# EAGLE design garage (EAGLE 8.2.2)
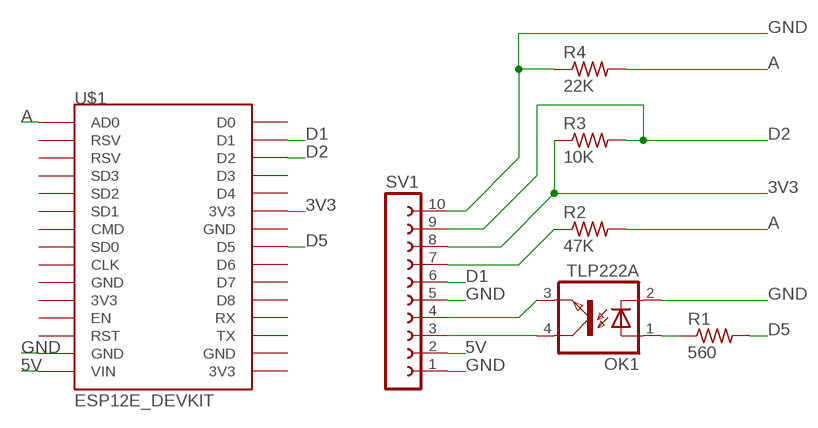
[diagram p0: schematic, sheet 1]

## Parts
OK1  TLP222A  TIL191  [DIL04]
R1  560  R-US_0207/7  [0207/7]
R2  47K  R-US_0207/7  [0207/7]
R3  10K  R-US_0207/7  [0207/7]
R4  22K  R-US_0207/7  [0207/7]
SV1  FE10W  [FE10W]
U$1  ESP12E_DEVKIT  [ESP12E_DEVKIT]

## Nets
3V3: R3.1 SV1.8 U$1.3V3@1(3V3)
5V: SV1.2 U$1.VIN
A: R2.2 R4.2 U$1.AD0
D1: SV1.6 U$1.D1
D2: R3.2 SV1.9 U$1.D2
D5: R1.2 U$1.D5
GND: OK1.2(C) R4.1 SV1.1 SV1.5 SV1.10 U$1.GND@1(GND)
N$1: OK1.4(COL) SV1.3
N$2: OK1.3(EMIT) SV1.4
N$3: OK1.1(A) R1.1
N$4: R2.1 SV1.7
Unconnected: U$1.3V3@0(3V3) U$1.3V3@2(3V3) U$1.CLK U$1.CMD U$1.D0 U$1.D3 U$1.D4 U$1.D6 U$1.D7 U$1.D8 U$1.EN U$1.GND@0(GND) U$1.GND@2(GND) U$1.GND@3(GND) U$1.RST U$1.RSV@0(RSV) U$1.RSV@1(RSV) U$1.RX U$1.SD0 U$1.SD1 U$1.SD2 U$1.SD3 U$1.TX

## Library data of the parts
OK1 = optocoupler-3-jcn:TIL191: TEXAS INSTRUMENTS OPTO COUPLER
R1-R4 = rcl:R-US_: RESISTOR, American symbol
SV1 = con-lsta:FE10W: FEMALE HEADER; OC_FARNELL: unknown; OC_NEWARK: unknown
U$1 = ESP12E_DEVKIT:ESP12E_DEVKIT: ESP12E DEVKIT BOARD

## Board
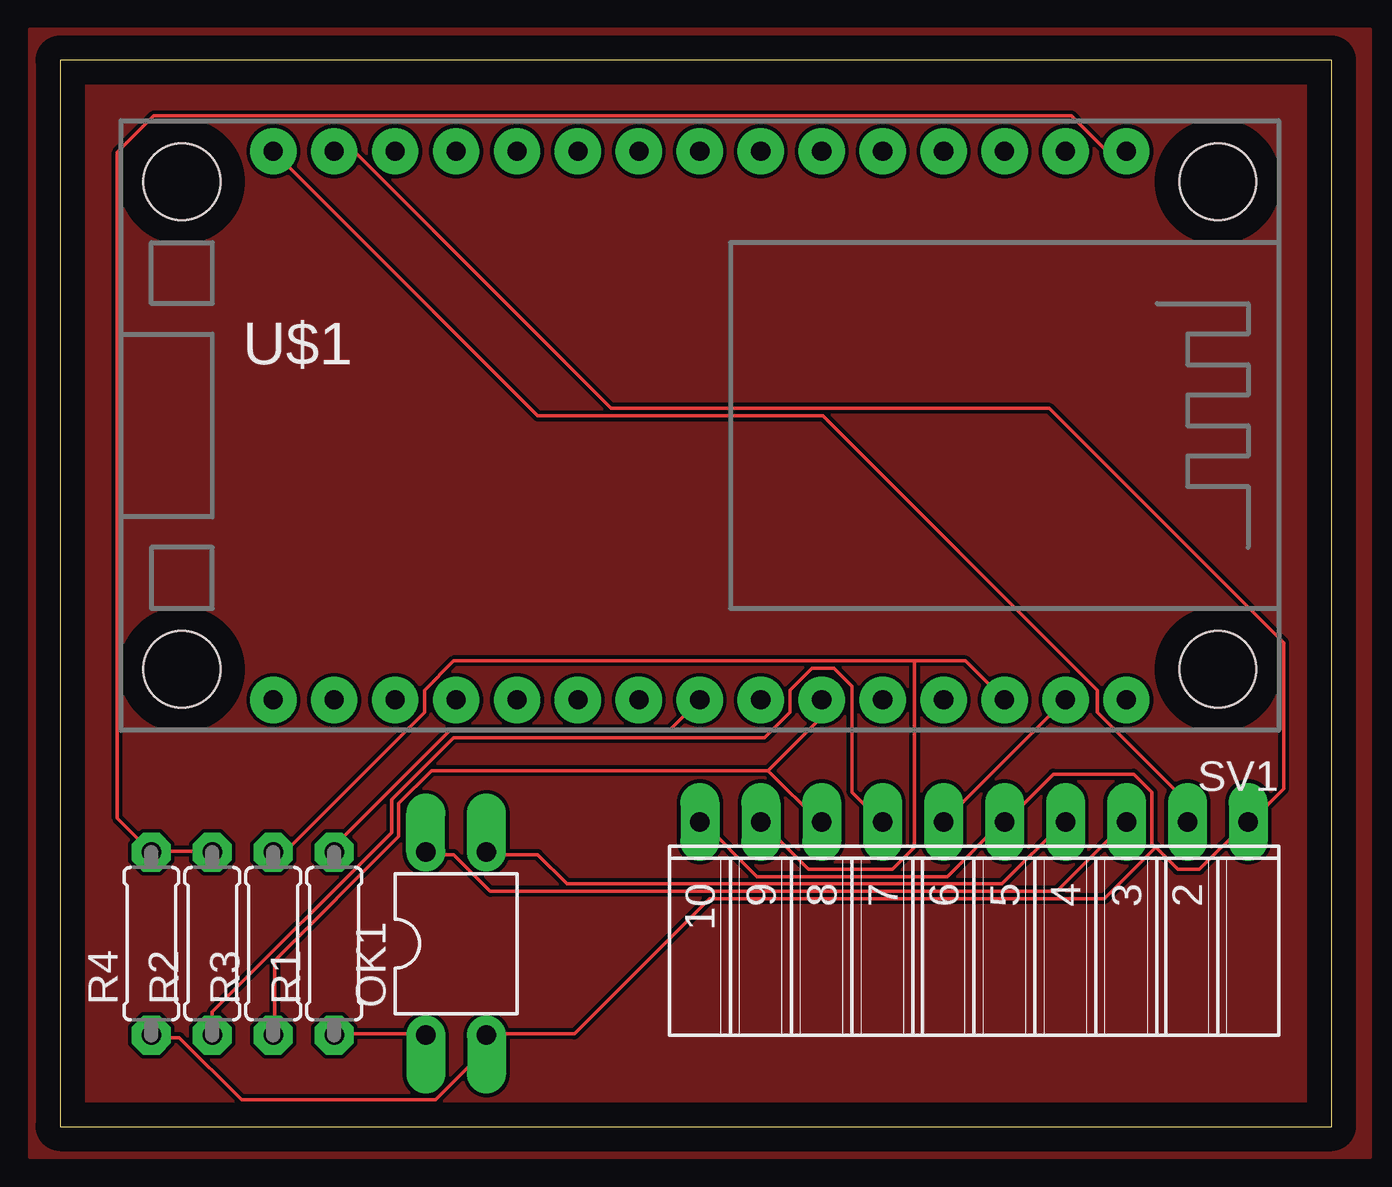
[diagram p1: board, top side]

Size 53.01 x 44.44 mm. Coordinates in mm from the lower left corner, seen from the top.
Outline: 0,0 53.01,0 53.01,44.44 0,44.44 0,0
Copper layers (1*16): Top 0.035mm / dielectric 1.5mm / Bottom 0.035mm
Design rules "default *": minimum track width 6mil, minimum drill 0.35mm, track to track 6mil, track to pad 6mil, pad to pad 6mil, via to via 6mil, smd to smd 6mil, copper to edge 40mil, drill to drill 6mil, minimum pad ring 16mil, minimum via ring 8mil, stop-mask expansion 4mil, vias tented up to drill 0mil, thermal gap 10mil

### Footprints (pad centres in the part's own frame; a part is rotated, then mirrored left to right if it is on the bottom)
DIL04 = drill 0.813 offset: 1 -1.27,-3.81; 2 1.27,-3.81; 3 1.27,3.81; 4 -1.27,3.81
0207/7 = drill 0.813 octagon: 1 -3.81,0; 2 3.81,0
FE10W = drill 0.813 long: 1 -11.43,0; 2 -8.89,0; 3 -6.35,0; 4 -3.81,0; 5 -1.27,0; 6 1.27,0; 7 3.81,0; 8 6.35,0; 9 8.89,0; 10 11.43,0
ESP12E_DEVKIT = drill 0.8 pad 1.93: 3V3@0 -11.43,-7.62; 3V3@1 11.43,5.08; 3V3@2 11.43,-17.78; AD0 -11.43,17.78; CLK -11.43,-2.54; CMD -11.43,2.54; D0 11.43,17.78; D1 11.43,15.24; D2 11.43,12.7; D3 11.43,10.16; D4 11.43,7.62; D5 11.43,0; D6 11.43,-2.54; D7 11.43,-5.08; D8 11.43,-7.62; EN -11.43,-10.16; GND@0 -11.43,-5.08; GND@1 -11.43,-15.24; GND@2 11.43,2.54; GND@3 11.43,-15.24; RST -11.43,-12.7; RSV@0 -11.43,15.24; RSV@1 -11.43,12.7; RX 11.43,-10.16; SD0 -11.43,0; SD1 -11.43,5.08; SD2 -11.43,7.62; SD3 -11.43,10.16; TX 11.43,-12.7; VIN -11.43,-17.78 | hole 3.2: -10.16,21.59; 10.16,21.59; 10.16,-21.59; -10.16,-21.59

### Placement (x,y rotation side)
OK1  16.51,7.62 0 top
R1  11.43,7.62 90 top
R2  6.35,7.62 90 top
R3  8.89,7.62 90 top
R4  3.81,7.62 90 top
SV1  38.1,12.7 180 top
U$1  26.67,29.21 270 top

### Tracks (layer width: path | path; a pad name or v marks a point on that pad's centre or on a via)
3V3
  Top 0.152: 29.52,14.83 15.49,14.83 14.12,13.46 14.12,12.09 8.94,6.91 8.94,3.86 R3.1 | 29.52,14.83 31.65,12.7 SV1.8 | 29.52,14.83 31.65,16.97 31.65,17.73 U$1.3V3@1
5V
  Top 0.152: U$1.VIN 19.91,29.62 31.8,29.62 43.23,18.19 43.23,17.27 46.89,13.61 46.89,12.7 SV1.2
A
  Top 0.152: R2.2 6.35,11.48 3.91,11.48 R4.2 2.39,12.85 2.39,40.59 3.91,42.11 42.16,42.11 43.54,40.74 44.45,40.74 U$1.AD0
D1
  Top 0.152: U$1.D1 SV1.6
D2
  Top 0.152: 35.61,19.41 37.74,19.41 U$1.D2 | 35.61,19.41 16.41,19.41 15.19,18.19 15.19,17.27 9.4,11.48 8.94,11.48 R3.2 | SV1.9 31.19,10.72 34.7,10.72 35.61,11.63 35.61,19.41
D5
  Top 0.152: U$1.D5 25.4,16.51 16.26,16.51 11.53,11.79 11.53,11.48 R1.2
GND
  Top 0.152: R4.1 3.91,3.71 4.98,3.71 7.57,1.12 15.65,1.12 17.78,3.25 OK1.2 17.78,3.86 21.44,3.86 27.08,9.5 43.54,9.5 45.67,11.63 | SV1.10 26.77,12.7 29.06,10.41 36.98,10.41 39.27,12.7 SV1.5 39.42,12.7 41.4,14.68 44.76,14.68 45.52,13.92 45.52,11.79 45.67,11.63 | 45.67,11.63 46.58,10.72 47.5,10.72 49.48,12.7 SV1.1 49.63,12.7 51,14.07 51,20.17 41.25,29.92 22.96,29.92 12.29,40.59 11.53,40.59 U$1.GND@1
N$1
  Top 0.152: SV1.3 41.55,9.8 17.93,9.8 16.41,11.33 15.34,11.33 OK1.4
N$2
  Top 0.152: OK1.3 17.78,11.33 19.91,11.33 21.13,10.11 39.27,10.11 41.86,12.7 SV1.4
N$3
  Top 0.152: R1.1 11.53,3.86 15.19,3.86 OK1.1
N$4
  Top 0.152: R2.1 6.35,4.77 13.82,12.24 13.82,13.61 16.41,16.21 29.36,16.21 30.43,17.27 30.43,18.19 31.34,19.1 32.26,19.1 33.02,18.34 33.02,13.92 34.24,12.7 SV1.7
N$5
  pour Top: -1.27,45.72 54.61,45.72 54.61,-1.27 -1.27,-1.27

### Text on the board
Document: GND / S1 / 3V3 / S2 / OPN / GND / BTN / BTN / +5V / GND